# Altium schematic sheet MCU_Headers.SchDoc
size A; SheetNumber: 7; SheetTotal: 8
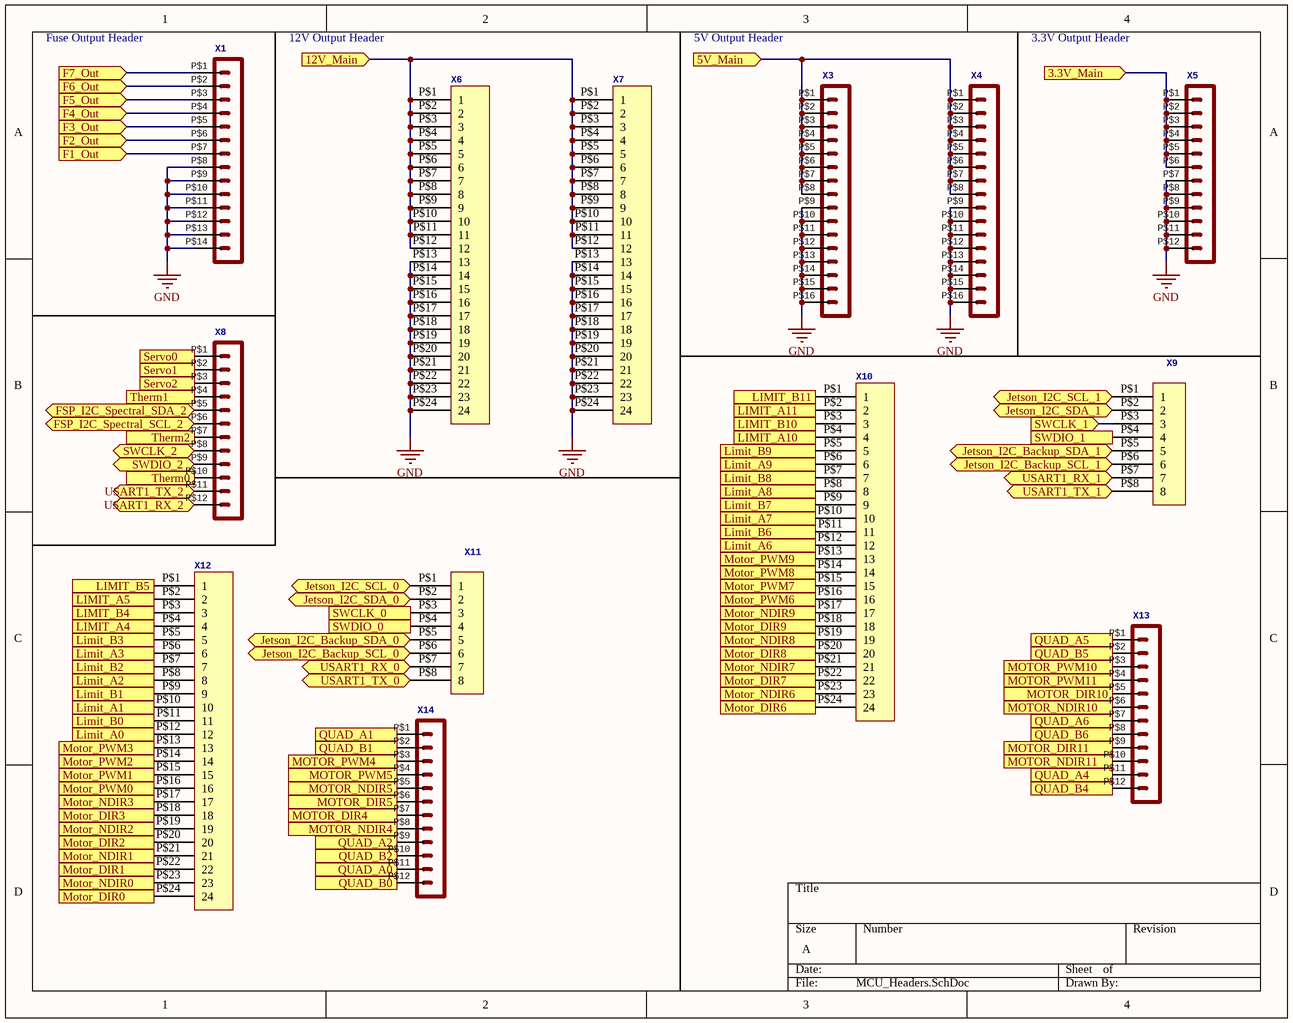
[diagram p0: MCU_Headers.SchDoc]

## Parts
X1  Molex - Micro-Fit 3.0 Series connector,  3.00mm (0.118") pitch header, 14 positions.  [43045-1412]  (value not drawn)
X3  Molex - Micro-Fit 3.0 Series connector,  3.00mm (0.118") pitch header, 16 positions.  [43045-1612]  (value not drawn)
X4  Molex - Micro-Fit 3.0 Series connector,  3.00mm (0.118") pitch header, 16 positions.  [43045-1612]  (value not drawn)
X5  Molex - Micro-Fit 3.0 Series connector,  3.00mm (0.118") pitch header, 12 positions.  [43045-1212]  (value not drawn)
X6  Molex 43045-2412  [43045-2412]  (value not drawn)
X7  Molex 43045-2412  [43045-2412]  (value not drawn)
X8  Molex - Micro-Fit 3.0 Series connector,  3.00mm (0.118") pitch header, 12 positions.  [43045-1212]  (value not drawn)
X9  Molex 43045-0812  [43045-0812]  (value not drawn)
X10  Molex 43045-2412  [43045-2412]  (value not drawn)
X11  Molex 43045-0812  [43045-0812]  (value not drawn)
X12  Molex 43045-2412  [43045-2412]  (value not drawn)
X13  Molex - Micro-Fit 3.0 Series connector,  3.00mm (0.118") pitch header, 12 positions.  [43045-1212]  (value not drawn)
X14  Molex - Micro-Fit 3.0 Series connector,  3.00mm (0.118") pitch header, 12 positions.  [43045-1212]  (value not drawn)

## Ports
3.3V_Main (in), 5V_Main (in), 12V_Main (in), F1_Out (in), F2_Out (in), F3_Out (in), F4_Out (in), F5_Out (in), F6_Out (in), F7_Out (in), FSP_I2C_Spectral_SCL_2 (bidir), FSP_I2C_Spectral_SDA_2 (bidir), Jetson_I2C_Backup_SCL_0 (bidir), Jetson_I2C_Backup_SCL_1 (bidir), Jetson_I2C_Backup_SDA_0 (bidir), Jetson_I2C_Backup_SDA_1 (bidir), Jetson_I2C_SCL_0 (bidir), Jetson_I2C_SCL_1 (bidir), Jetson_I2C_SDA_0 (bidir), Jetson_I2C_SDA_1 (bidir), Limit_A0 (in), Limit_A1 (in), Limit_A2 (in), Limit_A3 (in), LIMIT_A4 (in), LIMIT_A5 (in), Limit_A6 (out), Limit_A7 (out), Limit_A8 (out), Limit_A9 (out), LIMIT_A10 (in), LIMIT_A11 (in), Limit_B0 (in), Limit_B1 (in), Limit_B2 (in), Limit_B3 (in), LIMIT_B4 (in), LIMIT_B5 (in), Limit_B6 (out), Limit_B7 (out), Limit_B8 (out), Limit_B9 (out), LIMIT_B10 (in), LIMIT_B11 (in), Motor_DIR0 (in), Motor_DIR1 (in), Motor_DIR2 (in), Motor_DIR3 (in), MOTOR_DIR4 (in), MOTOR_DIR5 (in), Motor_DIR6 (out), Motor_DIR7 (out), Motor_DIR8 (out), Motor_DIR9 (out), MOTOR_DIR10 (in), MOTOR_DIR11 (in), Motor_NDIR0 (in), Motor_NDIR1 (in), Motor_NDIR2 (in), Motor_NDIR3 (in), MOTOR_NDIR4 (in), MOTOR_NDIR5 (in), Motor_NDIR6 (out), Motor_NDIR7 (out), Motor_NDIR8 (out), Motor_NDIR9 (out), MOTOR_NDIR10 (in), MOTOR_NDIR11 (in), Motor_PWM0 (in), Motor_PWM1 (in), Motor_PWM2 (in), Motor_PWM3 (in), MOTOR_PWM4 (in), MOTOR_PWM5 (in), Motor_PWM6 (out), Motor_PWM7 (out), Motor_PWM8 (out), Motor_PWM9 (out), MOTOR_PWM10 (in), MOTOR_PWM11 (in), QUAD_A0 (in), QUAD_A1 (in), QUAD_A2 (in), QUAD_A4 (in), QUAD_A5 (in), QUAD_A6 (in), QUAD_B0 (in), QUAD_B1 (in), QUAD_B2 (in), QUAD_B4 (in), QUAD_B5 (in), QUAD_B6 (in), Servo0 (in), Servo1 (in), Servo2 (in), SWCLK_0 (in), SWCLK_1 (in), SWCLK_2 (bidir), SWDIO_0 (in), SWDIO_1 (in), SWDIO_2 (bidir), Therm0 (in), Therm1 (in), Therm2 (in), USART1_RX_0 (bidir), USART1_RX_1 (bidir), USART1_RX_2 (bidir), USART1_TX_0 (bidir), USART1_TX_1 (bidir), USART1_TX_2 (bidir)

## Nets
GND: X1.P$8 X1.P$9 X1.P$10 X1.P$11 X1.P$12 X1.P$13 X1.P$14 X3.P$9 X3.P$10 X3.P$11 X3.P$12 X3.P$13 X3.P$14 X3.P$15 X3.P$16 X4.P$9 X4.P$10 X4.P$11 X4.P$12 X4.P$13 X4.P$14 X4.P$15 X4.P$16 X5.P$7 X5.P$8 X5.P$9 X5.P$10 X5.P$11 X5.P$12 X6.P$13(13) X6.P$14(14) X6.P$15(15) X6.P$16(16) X6.P$17(17) X6.P$18(18) X6.P$19(19) X6.P$20(20) X6.P$21(21) X6.P$22(22) X6.P$23(23) X6.P$24(24) X7.P$13(13) X7.P$14(14) X7.P$15(15) X7.P$16(16) X7.P$17(17) X7.P$18(18) X7.P$19(19) X7.P$20(20) X7.P$21(21) X7.P$22(22) X7.P$23(23) X7.P$24(24)
3.3V_Main: X5.P$1 X5.P$2 X5.P$3 X5.P$4 X5.P$5 X5.P$6 ; port 3.3V_Main
5V_Main: X3.P$1 X3.P$2 X3.P$3 X3.P$4 X3.P$5 X3.P$6 X3.P$7 X3.P$8 X4.P$1 X4.P$2 X4.P$3 X4.P$4 X4.P$5 X4.P$6 X4.P$7 X4.P$8 ; port 5V_Main
12V_Main: X6.P$1(1) X6.P$2(2) X6.P$3(3) X6.P$4(4) X6.P$5(5) X6.P$6(6) X6.P$7(7) X6.P$8(8) X6.P$9(9) X6.P$10(10) X6.P$11(11) X6.P$12(12) X7.P$1(1) X7.P$2(2) X7.P$3(3) X7.P$4(4) X7.P$5(5) X7.P$6(6) X7.P$7(7) X7.P$8(8) X7.P$9(9) X7.P$10(10) X7.P$11(11) X7.P$12(12) ; port 12V_Main
F1_Out: X1.P$7 ; port F1_Out
F2_Out: X1.P$6 ; port F2_Out
F3_Out: X1.P$5 ; port F3_Out
F4_Out: X1.P$4 ; port F4_Out
F5_Out: X1.P$3 ; port F5_Out
F6_Out: X1.P$2 ; port F6_Out
F7_Out: X1.P$1 ; port F7_Out
FSP_I2C_Spectral_SCL_2: X8.P$6 ; port FSP_I2C_Spectral_SCL_2
FSP_I2C_Spectral_SDA_2: X8.P$5 ; port FSP_I2C_Spectral_SDA_2
Jetson_I2C_Backup_SCL_0: X11.P$6(6) ; port Jetson_I2C_Backup_SCL_0
Jetson_I2C_Backup_SCL_1: X9.P$6(6) ; port Jetson_I2C_Backup_SCL_1
Jetson_I2C_Backup_SDA_0: X11.P$5(5) ; port Jetson_I2C_Backup_SDA_0
Jetson_I2C_Backup_SDA_1: X9.P$5(5) ; port Jetson_I2C_Backup_SDA_1
Jetson_I2C_SCL_0: X11.P$1(1) ; port Jetson_I2C_SCL_0
Jetson_I2C_SCL_1: X9.P$1(1) ; port Jetson_I2C_SCL_1
Jetson_I2C_SDA_0: X11.P$2(2) ; port Jetson_I2C_SDA_0
Jetson_I2C_SDA_1: X9.P$2(2) ; port Jetson_I2C_SDA_1
Limit_A0: X12.P$12(12) ; port Limit_A0
Limit_A1: X12.P$10(10) ; port Limit_A1
Limit_A2: X12.P$8(8) ; port Limit_A2
Limit_A3: X12.P$6(6) ; port Limit_A3
LIMIT_A4: X12.P$4(4) ; port LIMIT_A4
LIMIT_A5: X12.P$2(2) ; port LIMIT_A5
Limit_A6: X10.P$12(12) ; port Limit_A6
Limit_A7: X10.P$10(10) ; port Limit_A7
Limit_A8: X10.P$8(8) ; port Limit_A8
Limit_A9: X10.P$6(6) ; port Limit_A9
LIMIT_A10: X10.P$4(4) ; port LIMIT_A10
LIMIT_A11: X10.P$2(2) ; port LIMIT_A11
Limit_B0: X12.P$11(11) ; port Limit_B0
Limit_B1: X12.P$9(9) ; port Limit_B1
Limit_B2: X12.P$7(7) ; port Limit_B2
Limit_B3: X12.P$5(5) ; port Limit_B3
LIMIT_B4: X12.P$3(3) ; port LIMIT_B4
LIMIT_B5: X12.P$1(1) ; port LIMIT_B5
Limit_B6: X10.P$11(11) ; port Limit_B6
Limit_B7: X10.P$9(9) ; port Limit_B7
Limit_B8: X10.P$7(7) ; port Limit_B8
Limit_B9: X10.P$5(5) ; port Limit_B9
LIMIT_B10: X10.P$3(3) ; port LIMIT_B10
LIMIT_B11: X10.P$1(1) ; port LIMIT_B11
Motor_DIR0: X12.P$24(24) ; port Motor_DIR0
Motor_DIR1: X12.P$22(22) ; port Motor_DIR1
Motor_DIR2: X12.P$20(20) ; port Motor_DIR2
Motor_DIR3: X12.P$18(18) ; port Motor_DIR3
MOTOR_DIR4: X14.P$7 ; port MOTOR_DIR4
MOTOR_DIR5: X14.P$6 ; port MOTOR_DIR5
Motor_DIR6: X10.P$24(24) ; port Motor_DIR6
Motor_DIR7: X10.P$22(22) ; port Motor_DIR7
Motor_DIR8: X10.P$20(20) ; port Motor_DIR8
Motor_DIR9: X10.P$18(18) ; port Motor_DIR9
MOTOR_DIR10: X13.P$5 ; port MOTOR_DIR10
MOTOR_DIR11: X13.P$9 ; port MOTOR_DIR11
Motor_NDIR0: X12.P$23(23) ; port Motor_NDIR0
Motor_NDIR1: X12.P$21(21) ; port Motor_NDIR1
Motor_NDIR2: X12.P$19(19) ; port Motor_NDIR2
Motor_NDIR3: X12.P$17(17) ; port Motor_NDIR3
MOTOR_NDIR4: X14.P$8 ; port MOTOR_NDIR4
MOTOR_NDIR5: X14.P$5 ; port MOTOR_NDIR5
Motor_NDIR6: X10.P$23(23) ; port Motor_NDIR6
Motor_NDIR7: X10.P$21(21) ; port Motor_NDIR7
Motor_NDIR8: X10.P$19(19) ; port Motor_NDIR8
Motor_NDIR9: X10.P$17(17) ; port Motor_NDIR9
MOTOR_NDIR10: X13.P$6 ; port MOTOR_NDIR10
MOTOR_NDIR11: X13.P$10 ; port MOTOR_NDIR11
Motor_PWM0: X12.P$16(16) ; port Motor_PWM0
Motor_PWM1: X12.P$15(15) ; port Motor_PWM1
Motor_PWM2: X12.P$14(14) ; port Motor_PWM2
Motor_PWM3: X12.P$13(13) ; port Motor_PWM3
MOTOR_PWM4: X14.P$3 ; port MOTOR_PWM4
MOTOR_PWM5: X14.P$4 ; port MOTOR_PWM5
Motor_PWM6: X10.P$16(16) ; port Motor_PWM6
Motor_PWM7: X10.P$15(15) ; port Motor_PWM7
Motor_PWM8: X10.P$14(14) ; port Motor_PWM8
Motor_PWM9: X10.P$13(13) ; port Motor_PWM9
MOTOR_PWM10: X13.P$3 ; port MOTOR_PWM10
MOTOR_PWM11: X13.P$4 ; port MOTOR_PWM11
QUAD_A0: X14.P$11 ; port QUAD_A0
QUAD_A1: X14.P$1 ; port QUAD_A1
QUAD_A2: X14.P$9 ; port QUAD_A2
QUAD_A4: X13.P$11 ; port QUAD_A4
QUAD_A5: X13.P$1 ; port QUAD_A5
QUAD_A6: X13.P$7 ; port QUAD_A6
QUAD_B0: X14.P$12 ; port QUAD_B0
QUAD_B1: X14.P$2 ; port QUAD_B1
QUAD_B2: X14.P$10 ; port QUAD_B2
QUAD_B4: X13.P$12 ; port QUAD_B4
QUAD_B5: X13.P$2 ; port QUAD_B5
QUAD_B6: X13.P$8 ; port QUAD_B6
Servo0: X8.P$1 ; port Servo0
Servo1: X8.P$2 ; port Servo1
Servo2: X8.P$3 ; port Servo2
SWCLK_0: X11.P$3(3) ; port SWCLK_0
SWCLK_1: X9.P$3(3) ; port SWCLK_1
SWCLK_2: X8.P$8 ; port SWCLK_2
SWDIO_0: X11.P$4(4) ; port SWDIO_0
SWDIO_1: X9.P$4(4) ; port SWDIO_1
SWDIO_2: X8.P$9 ; port SWDIO_2
Therm0: X8.P$10 ; port Therm0
Therm1: X8.P$4 ; port Therm1
Therm2: X8.P$7 ; port Therm2
USART1_RX_0: X11.P$7(7) ; port USART1_RX_0
USART1_RX_1: X9.P$7(7) ; port USART1_RX_1
USART1_RX_2: X8.P$12 ; port USART1_RX_2
USART1_TX_0: X11.P$8(8) ; port USART1_TX_0
USART1_TX_1: X9.P$8(8) ; port USART1_TX_1
USART1_TX_2: X8.P$11 ; port USART1_TX_2

## Notes on the sheet
- Fuse Output Header
- 12V Output Header
- 5V Output Header
- 3.3V Output Header

## Library data of the parts
X1 = HEADER_POS14_?43045-1412: GateName_1: G$1; SymbolName_1: HEADER_POS14; DeviceName: 43045-1412; LibraryName: con-molex-micro-fit-3_0_2; DeviceSetName: HEADER_POS14_?; Package: 43045-1412
X3 X4 = HEADER_POS16_?43045-1612: GateName_1: G$1; SymbolName_1: HEADER_POS16; DeviceName: 43045-1612; LibraryName: con-molex-micro-fit-3_0_2; DeviceSetName: HEADER_POS16_?; Package: 43045-1612
X5 X8 X13 X14 = HEADER_POS12_?43045-1212: GateName_1: G$1; SymbolName_1: HEADER_POS12; DeviceName: 43045-1212; LibraryName: con-molex-micro-fit-3_0_2; DeviceSetName: HEADER_POS12_?; Package: 43045-1212
X6 X7 X10 X12 = Micro-Fit Molex 24 Pin Vertical: GateName_1: G$1; SymbolName_1: HEADER_POS24; DeviceSetName: HEADER_POS24_?; DeviceName: 43045-2412; LibraryName: con-molex-micro-fit-3_0_2; Package: 43045-2412
X9 X11 = Micro-Fit Molex 8 Pin 2 Row Vertical: GateName_1: G$1; SymbolName_1: HEADER_POS8; DeviceSetName: HEADER_POS8_?; DeviceName: 43045-0812; LibraryName: con-molex-micro-fit-3_0_2; Package: 43045-0812